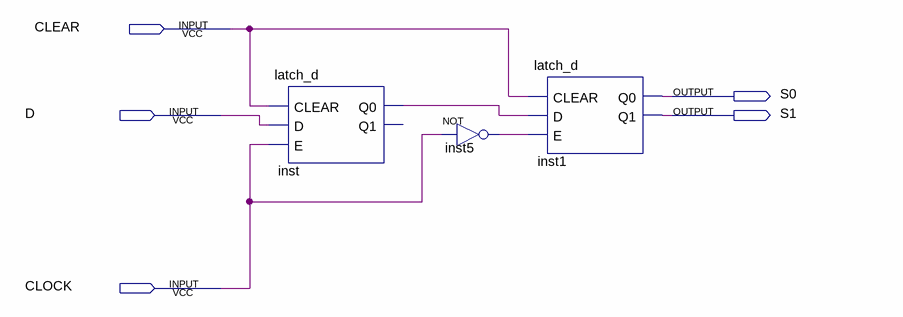
[diagram p0: schematic sheet]
// Quartus schematic flipflop_descida.bdf as structural Verilog: 3 symbols, 5 pins
module flipflop_descida (
  input  CLEAR,
  input  D,
  input  CLOCK,
  output S0,
  output S1
);

  wire inst5_out, inst_q0;

  latch_d inst (.CLEAR(CLEAR), .D(D), .E(CLOCK), .Q0(inst_q0));  // open: Q1
  not inst5 (inst5_out, CLOCK);
  latch_d inst1 (.CLEAR(CLEAR), .D(inst_q0), .E(inst5_out), .Q0(S0), .Q1(S1));
endmodule
